# EAGLE design design_block-readable (EAGLE 9.3.0)
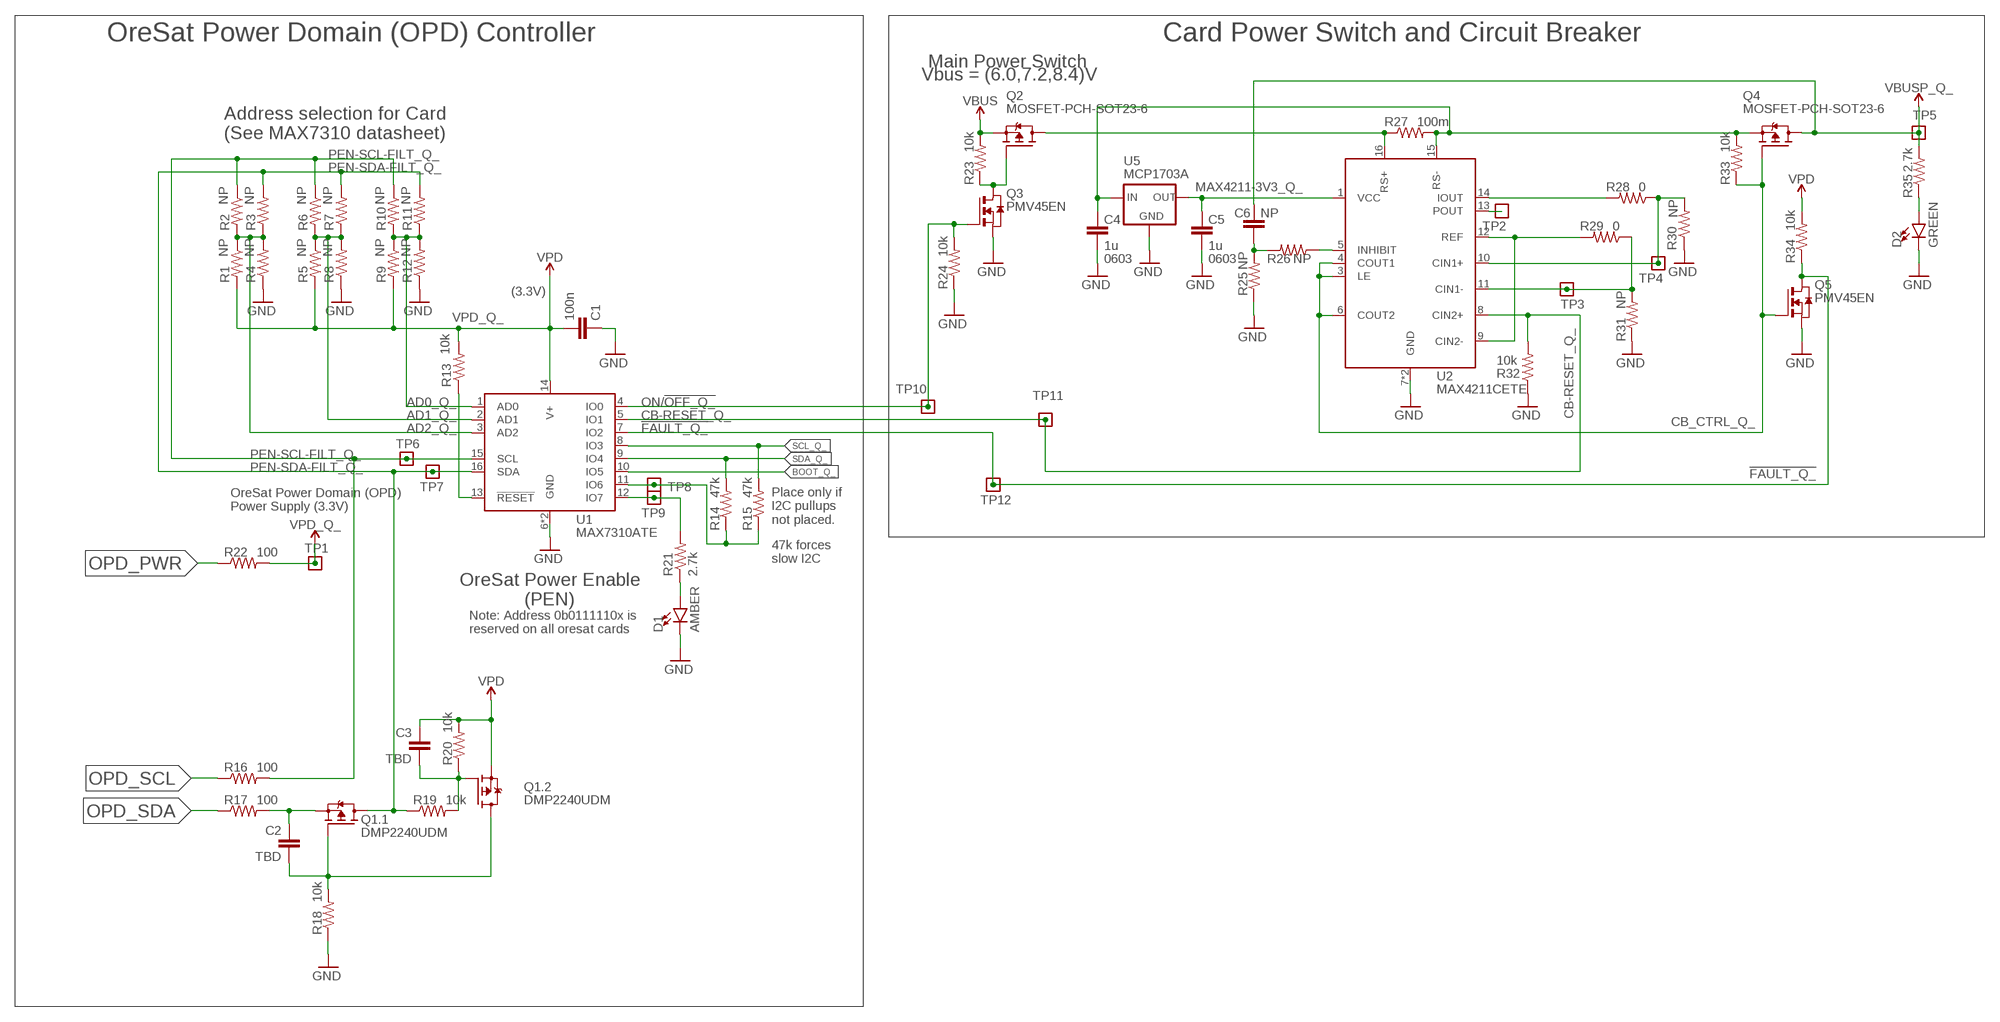
[diagram p0: schematic, sheet 1]

## Parts
C1  100n  C-EU0402-B-NOSILK  [.0402-B-NOSILK]
C2  TBD  C-EU0402-B-NOSILK  [.0402-B-NOSILK]
C3  TBD  C-EU0402-B-NOSILK  [.0402-B-NOSILK]
C4  1u  C-EU0603-B-NOSILK  [.0603-B-NOSILK]
C5  1u  C-EU0603-B-NOSILK  [.0603-B-NOSILK]
C6  NP  C-EU0402-B-NOSILK  [.0402-B-NOSILK]
D1  AMBER  LED-GREEN0603  [LED-0603]
D2  GREEN  LED-GREEN0603  [LED-0603]
Q1  DMP2240UDM  MOSFET-PCH-SOT23-6  [SOT23-6]
Q2  MOSFET-PCH-SOT23-6  [SOT23-6]
Q3  PMV45EN  [SOT23]
Q4  MOSFET-PCH-SOT23-6  [SOT23-6]
Q5  PMV45EN  [SOT23]
R1  NP  R-US_0402-B-NOSILK  [.0402-B-NOSILK]
R2  NP  R-US_0402-B-NOSILK  [.0402-B-NOSILK]
R3  NP  R-US_0402-B-NOSILK  [.0402-B-NOSILK]
R4  NP  R-US_0402-B-NOSILK  [.0402-B-NOSILK]
R5  NP  R-US_0402-B-NOSILK  [.0402-B-NOSILK]
R6  NP  R-US_0402-B-NOSILK  [.0402-B-NOSILK]
R7  NP  R-US_0402-B-NOSILK  [.0402-B-NOSILK]
R8  NP  R-US_0402-B-NOSILK  [.0402-B-NOSILK]
R9  NP  R-US_0402-B-NOSILK  [.0402-B-NOSILK]
R10  NP  R-US_0402-B-NOSILK  [.0402-B-NOSILK]
R11  NP  R-US_0402-B-NOSILK  [.0402-B-NOSILK]
R12  NP  R-US_0402-B-NOSILK  [.0402-B-NOSILK]
R13  10k  R-US_0402-B-NOSILK  [.0402-B-NOSILK]
R14  47k  R-US_0402-B-NOSILK  [.0402-B-NOSILK]
R15  47k  R-US_0402-B-NOSILK  [.0402-B-NOSILK]
R16  100  R-US_0402-B-NOSILK  [.0402-B-NOSILK]
R17  100  R-US_0402-B-NOSILK  [.0402-B-NOSILK]
R18  10k  R-US_0402-B-NOSILK  [.0402-B-NOSILK]
R19  10k  R-US_0402-B-NOSILK  [.0402-B-NOSILK]
R20  10k  R-US_0402-B-NOSILK  [.0402-B-NOSILK]
R21  2.7k  R-US_0402-B-NOSILK  [.0402-B-NOSILK]
R22  100  R-US_0402-B-NOSILK  [.0402-B-NOSILK]
R23  10k  R-US_0402-B-NOSILK  [.0402-B-NOSILK]
R24  10k  R-US_0402-B-NOSILK  [.0402-B-NOSILK]
R25  NP  R-US_0402-B-NOSILK  [.0402-B-NOSILK]
R26  NP  R-US_0402-B-NOSILK  [.0402-B-NOSILK]
R27  100m  R-US_R1206  [R1206]
R28  0  R-US_0402-B-NOSILK  [.0402-B-NOSILK]
R29  0  R-US_0402-B-NOSILK  [.0402-B-NOSILK]
R30  NP  R-US_0402-B-NOSILK  [.0402-B-NOSILK]
R31  NP  R-US_0402-B-NOSILK  [.0402-B-NOSILK]
R32  10k  R-US_0402-B-NOSILK  [.0402-B-NOSILK]
R33  10k  R-US_0402-B-NOSILK  [.0402-B-NOSILK]
R34  10k  R-US_0402-B-NOSILK  [.0402-B-NOSILK]
R35  2.7k  R-US_0402-B-NOSILK  [.0402-B-NOSILK]
TP1  TEST-POINT  [2MM-TEST-POINT]
TP2  TEST-POINT  [2MM-TEST-POINT]
TP3  TEST-POINT  [2MM-TEST-POINT]
TP4  TEST-POINT  [2MM-TEST-POINT]
TP5  TEST-POINT  [2MM-TEST-POINT]
TP6  TEST-POINT  [2MM-TEST-POINT]
TP7  TEST-POINT  [2MM-TEST-POINT]
TP8  TEST-POINT  [2MM-TEST-POINT]
TP9  TEST-POINT  [2MM-TEST-POINT]
TP10  TEST-POINT  [2MM-TEST-POINT]
TP11  TEST-POINT  [2MM-TEST-POINT]
TP12  TEST-POINT  [2MM-TEST-POINT]
U1  MAX7310ATE  MAX7310  [QFN65P400X400X80-17T210]
U2  MAX4211CETE  MAX4211  [QFN65P400X400X80-17T210]
U5  MCP1703A  XC63FPM  [SOT23]

## Nets
!FAULT_Q_: Q5.3(D) R34.1 TP12.1 U1.7(IO2)
AD0_Q_: R9.1 R10.2 R11.1 R12.2 U1.1(AD0)
AD1_Q_: R5.1 R6.2 R7.1 R8.2 U1.2(AD1)
AD2_Q_: R1.1 R2.2 R3.1 R4.2 U1.3(AD2)
BOOT_Q_: U1.10(IO5)
CB-RESET_Q_: R32.2 TP11.1 U1.5(IO1) U2.8(CIN2+)
CB_CTRL_Q_: Q4.3(G) Q5.1(G) R33.1 U2.3(LE) U2.4(COUT1) U2.6(COUT2)
GND: C1.1 C4.2 C5.2 D1.C D2.C Q3.2(S) Q5.2(S) R4.1 R8.1 R12.1 R18.1 R24.1 R25.1 R30.1 R31.1 R32.1 U1.6(GND) U1.EPAD(GND) U2.7(GND) U2.EPAD(GND) U5.1(GND)
MAX4211-3V3_Q_: C5.1 U2.1(VCC) U5.2(OUT)
N$2: D2.A R35.1
N$3: R13.1 U1.13(!RESET)
N$4: Q2.3(G) Q3.3(D) R23.1
N$5: Q2.1(D) Q2.2(D) Q2.5(D) Q2.6(D) R27.1 U2.16(RS+)
N$6: R28.1 R30.2 TP4.1 U2.10(CIN1+)
N$7: R29.1 R31.2 TP3.1 U2.11(CIN1-)
N$8: R28.2 U2.14(IOUT)
N$9: R29.2 U2.9(CIN2-) U2.12(REF)
N$10: TP2.1 U2.13(POUT)
N$11: R26.1 U2.5(INHIBIT)
N$12: C6.1 R25.2 R26.2
N$13: C4.1 Q4.4(S) R27.2 R33.2 U2.15(RS-) U5.3(IN)
N$14: R21.2 TP9.1 U1.12(IO7)
N$15: D1.A R21.1
N$16: C2.1 Q1.5(.1:S) R17.2
N$17: C2.2 Q1.1(.1:G) Q1.4(.2:D) R18.2
N$18: C3.2 Q1.3(.2:G) R19.2 R20.1
N$19: R14.1 R15.1 TP8.1 U1.11(IO6)
ON/!OFF_Q_: Q3.1(G) R24.2 TP10.1 U1.4(IO0)
OPD_PWR: R22.1
OPD_SCL: R16.1
OPD_SDA: R17.1
PEN-SCL-FILT_Q_: R2.1 R6.1 R10.1 R16.2 TP6.1 U1.15(SCL)
PEN-SDA-FILT_Q_: Q1.6(.1:D) R3.2 R7.2 R11.2 R19.1 TP7.1 U1.16(SDA)
SCL_Q_: R15.2 U1.8(IO3)
SDA_Q_: R14.2 U1.9(IO4)
VBUS: Q2.4(S) R23.2
VBUSP_Q_: C6.2 Q4.1(D) Q4.2(D) Q4.5(D) Q4.6(D) R35.2 TP5.1
VPD_Q_: C1.2 C3.1 Q1.2(.2:S) R1.2 R5.2 R9.2 R13.2 R20.2 R22.2 R34.2 TP1.1 U1.14(V+) ; supply symbol labelled VPD

## Notes on the sheet
- OreSat Power Domain (OPD) Controller | Card Power Switch and Circuit Breaker
- Main Power Switch
- Vbus = (6.0,7.2,8.4)V
- Address selection for Card
  (See MAX7310 datasheet)
- 0603 | 0603
- (3.3V)
- OreSat Power Domain (OPD)
  Power Supply (3.3V)
- Place only if
  I2C pullups
  not placed.
- 47k forces
  slow I2C
- OreSat Power Enable
  (PEN)
- Note: Address 0b0111110x is 
  reserved on all oresat cards

## Library data of the parts
C1-C3 C6 = rcl_custom:C-EU: CAPACITOR, European symbol; DIS: Digi-Key; DPN: 1276-1001-1-ND; MFR: Samsung; MPN: CL05B104KO5NNNC
C4 C5 = oresat-rcl:C-EU: CAPACITOR, European symbol; DIS: Digi-Key; DPN: 1276-1001-1-ND; MFR: Samsung; MPN: CL05B104KO5NNNC
D1 = SparkFun-LED:LED-GREEN: Green SMD LED Used in manufacturing of various products at SparkFun Packages: 0603 - SMD 0603 package [Product Link] <http://www.futureelectronics.com/en/technologies/semiconductors/optoelectronics/leds/Pages/9894312-LTST-C190GKT.aspx?CrossPart=HSMG-C190&IM=0> LilyPad 1206 - SMD1206 LilyPad package [Product Link] <http://www.futureelectronics.com/en/Technologies/Product.aspx?ProductID=IN150NGHARVATEKCORPORATION2049943&IM=0> 1206 - SMD1206 package [Product Link] <http://www.futureelectronics.com/en/technologies/semiconductors/optoelectronics/leds/Pages/8315665-LTST-C150KGKT.aspx?IM=0> 1206 Bottom Mount -SMD 1206 Bottom Mount [Product Link] <http://www.digikey.com/product-detail/en/lite-on-inc/LTST-C230KGKT/160-1456-1-ND/386854> SparkFun Products: Pro Mini 328 -5V <https://www.sparkfun.com/products/821> RedBoard <https://www.sparkfun.com/products/12757> MP3 Trigger <https://www.sparkfun.com/products/13720> Makey Makey <https://www.sparkfun.com/products/11076>; VALUE: GREEN
D2 = SparkFun-LED:LED-GREEN: Green SMD LED Used in manufacturing of various products at SparkFun Packages: 0603 - SMD 0603 package [Product Link] <http://www.futureelectronics.com/en/technologies/semiconductors/optoelectronics/leds/Pages/9894312-LTST-C190GKT.aspx?CrossPart=HSMG-C190&IM=0> LilyPad 1206 - SMD1206 LilyPad package [Product Link] <http://www.futureelectronics.com/en/Technologies/Product.aspx?ProductID=IN150NGHARVATEKCORPORATION2049943&IM=0> 1206 - SMD1206 package [Product Link] <http://www.futureelectronics.com/en/technologies/semiconductors/optoelectronics/leds/Pages/8315665-LTST-C150KGKT.aspx?IM=0> 1206 Bottom Mount -SMD 1206 Bottom Mount [Product Link] <http://www.digikey.com/product-detail/en/lite-on-inc/LTST-C230KGKT/160-1456-1-ND/386854> SparkFun Products: Pro Mini 328 -5V <https://www.sparkfun.com/products/821> RedBoard <https://www.sparkfun.com/products/12757> MP3 Trigger <https://www.sparkfun.com/products/13720> Makey Makey <https://www.sparkfun.com/products/11076>
Q1 = Q-MOSFET-PCH-dual-SOT23-6:MOSFET-PCH-SOT23-6: Dual P channel MOSFETs in an SOT23-6; MFR: Diodes Inc; MPN: DMP2240UDM
Q2 Q4 = Q-MOSFET-PCH-SOT23-6:MOSFET-PCH-SOT23-6: P channel MOSFET in an SOT23-6; MFR: Diodes Inc; MPN: DMP3050LVT-7
Q3 Q5 = Tova:PMV45EN
R1-R26 R28-R35 = rcl_custom:R-US_: RESISTOR, American symbol; DIS: Digi-Key; DPN: 1276-4275-1-ND; MFR: Samsung; MPN: RC1005F6653CS
R27 = rcl:R-US_: RESISTOR, American symbol; SPICEPREFIX: R
TP1-TP12 = Tova:TEST-POINT
U1 = U-Maxim-MAX7310-I2C-GPIO-expander:MAX7310; MFR: Maxim; MPN: MAX7310ATE
U2 = U-Maxim-MAX4211-power-monitor:MAX4211; MFR: Maxim; MPN: MAX4211CETE
U5 = v-reg:XC63FP: Positiv Voltage Regulators www.torex.co.jp/english/product/pro02/pdf/0201_xc62fp.pdf; MFR: Microchip; MPN: MCP1703AT-3302E/CB

## Board
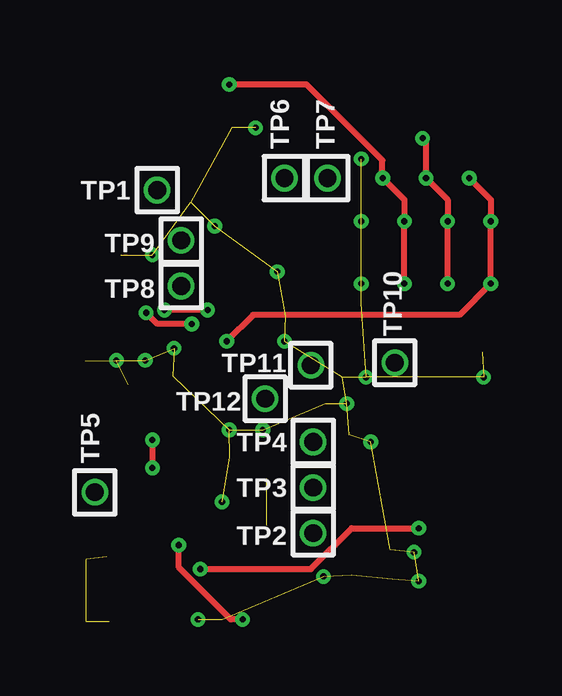
[diagram p1: board, top side]
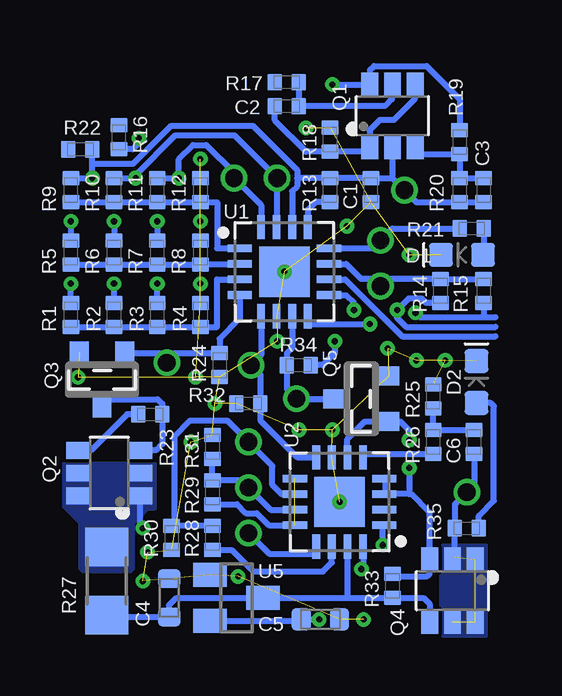
[diagram p2: board, bottom side, seen from below]

No outline drawn. Coordinates in mm, seen from the top.
Copper layers (1*16): Top 0.0356mm / dielectric 1.5011mm / Bottom 0.0356mm
Design rules "OSH-Park-2-layer *": minimum track width 6mil, minimum drill 10mil, track to track 6mil, track to pad 6mil, pad to pad 6mil, via to via 6mil, smd to smd 6mil, copper to edge 15mil, drill to drill 6mil, minimum pad ring 7mil, minimum via ring 7mil, stop-mask expansion 3mil, vias tented up to drill 13mil, thermal gap 10mil

### Footprints (pad centres in the part's own frame; a part is rotated, then mirrored left to right if it is on the bottom)
.0402-B-NOSILK = smd 0.6 x 0.7: 1 -0.5,0; 2 0.5,0
.0603-B-NOSILK = smd 0.8 x 0.95: 1 -0.8,0; 2 0.8,0
LED-0603 = smd 1 x 1: A -0.877,0; C 0.877,0
SOT23-6 = smd 0.7 x 1: 1 -0.95,-1.3; 2 0,-1.3; 3 0.95,-1.3; 4 0.95,1.3; 5 0,1.3; 6 -0.95,1.3
SOT23 = smd 0.787 x 0.889: 1 -0.953,-1.143; 2 0.953,-1.143; 3 0,1.143
R1206 = smd 1.6 x 1.803: 1 -1.422,0; 2 1.422,0
2MM-TEST-POINT = drill 0.737: 1 0,0
QFN65P400X400X80-17T210 = smd 1.01 x 0.32: 1 -1.86,0.975; 2 -1.86,0.325; 3 -1.86,-0.325; 4 -1.86,-0.975; 9 1.86,-0.975; 10 1.86,-0.325; 11 1.86,0.325; 12 1.86,0.975 | smd 0.32 x 1.01: 5 -0.975,-1.86; 6 -0.325,-1.86; 7 0.325,-1.86; 8 0.975,-1.86; 13 0.975,1.86; 14 0.325,1.86; 15 -0.325,1.86; 16 -0.975,1.86 | smd 2.1 x 2.1: EPAD 0,0
SOT23' = smd 1 x 1.4: 1 -0.95,-1.1; 2 0.95,-1.1; 3 0,1.1

### Placement (x,y rotation side)
C1  5.5,18.9 90 bottom
C2  9,22.4 180 bottom
C3  0.8,18.9 90 bottom
C4  13.9,1.9 90 bottom
C5  7.6,1 0 bottom
C6  1.2,8.4 270 bottom
D1  1.7,16.2 180 bottom
D2  1.1,10.9 90 bottom
Q1  4.6,22 0 bottom
Q2  16.4,7.1 90 bottom
Q3  16.7,11 180 bottom
Q4  2.1,2.2 180 bottom
Q5  5.9,10.2 90 bottom
R1  18,13.7 90 bottom
R2  16.2,13.7 270 bottom
R3  14.4,13.7 90 bottom
R4  12.6,13.7 270 bottom
R5  18,16.3 90 bottom
R6  16.2,16.3 270 bottom
R7  14.4,16.3 90 bottom
R8  12.6,16.3 270 bottom
R9  18,18.9 90 bottom
R10  16.2,18.9 270 bottom
R11  14.4,18.9 90 bottom
R12  12.6,18.9 270 bottom
R13  7.2,18.9 90 bottom
R14  2.6,14.7 270 bottom
R15  0.8,14.7 270 bottom
R16  16,21.1 270 bottom
R17  9,23.4 0 bottom
R18  7.2,21 270 bottom
R19  1.8,20.9 270 bottom
R20  1.8,18.9 270 bottom
R21  1.3,17.3 180 bottom
R22  17.6,20.6 0 bottom
R23  14.69,9.55 180 bottom
R24  11.8,11.6 90 bottom
R25  2.9,10.3 270 bottom
R26  2.9,8.4 90 bottom
R27  16.5,2.6 270 bottom
R28  12.1,4.4 270 bottom
R29  12.1,6.3 270 bottom
R30  13.8,4.4 90 bottom
R31  12.1,8.2 270 bottom
R32  10.6,10 0 bottom
R33  4.6,2.4 270 bottom
R34  8.5,11.6 0 bottom
R35  1.5,4.8 180 bottom
TP1  4.1,18.9 180 top
TP2  10.6,4.6 180 top
TP3  10.6,6.5 180 top
TP4  10.6,8.4 0 top
TP5  1.5,6.3 180 top
TP6  9.4,19.4 180 top
TP7  11.2,19.4 180 top
TP8  5.1,14.9 180 top
TP9  5.1,16.8 180 top
TP10  14,11.7 180 top
TP11  10.5,11.6 180 top
TP12  8.6,10.2 180 top
U1  9.1,15.5 0 bottom
U2  6.8,5.9 180 bottom
U5  MCP1703A  [SOT23']  11.1,1.9 270 bottom

### Tracks (layer width: path | path; a pad name or v marks a point on that pad's centre or on a via)
!FAULT_Q_
  Bottom 0.25: Q5.3 TP12.1 9,10.6 R34.1 9,12.1 8.78,12.32 U1.7
AD0_Q_
  Bottom 0.25: R9.1 R10.2 R11.1 R12.2 11.9,18.4 11.9,16.48 U1.1
AD1_Q_
  Bottom 0.25: R5.1 R6.2 R7.1 R8.2 12.57,15.82 U1.2
AD2_Q_
  Bottom 0.25: R1.1 R2.2 R3.1 R4.2 11.9,13.2 11.9,15.18 U1.3
BOOT_Q_
  Bottom 0.25: U1.10 6.58,15.18 4.2,12.8 0.3,12.8
CB-RESET_Q_
  Bottom 0.25: U1.5 10.07,12.03 TP11.1 10.1,11.2 R32.2 10.1,9.3 8.56,7.76 U2.8
CB_CTRL_Q_  (via drill 0.25)
  Top 0.25: v3.9,8.48 v3.9,7.32
  Bottom 0.25: U2.6 6.47,8.53 5.75,9.25 Q5.1 4.26,9.25 3.9,8.88 v3.9,8.48 | R33.1 4.5,2.8 3.15,2.8 3.05,2.9 Q4.3 3.05,5.45 3.83,6.22 3.9,6.22 | 3.9,6.22 4.9,6.22 | 4.9,6.22 U2.3 | U2.4 4.9,6.83 4.9,6.22 | v3.9,7.32 3.9,6.22
GND  (via drill 0.25)  (40 unrouted)
  other vias: 12.6,20.2 12.6,17.6 12.6,15 12.8,11.1 13,8.4 12,10 9.4,12.6 6.5,17.4 8.2,21.5 3.9,16.2 2.4,11.8 3.6,11.8 4.8,12.3 7.1,8.9 8.5,8.9 14.8,3.8 15,2.6 11.03,2.79 5.8,1 17.7,11.1 9.1,15.5 6.8,5.9
MAX4211-3V3_Q_  (via drill 0.25)
  Top 0.25: v7.66,1 7.17,1 5,3.17 v5,4.1
  Bottom 0.25: U5.2 8.45,0.95 C5.1 v7.66,1 | v5,4.1 5,4.87 U2.1
N$2
  Bottom 0.25: R35.1 1,5.33 0.37,5.95 0.37,9.9 0.5,10.02 D2.A
N$3
  Bottom 0.25: R13.1 7.8,18.4 8.12,18.07 U1.13
N$4
  Bottom 0.25: Q3.3 16.7,10.18 14.38,10.18 14.19,9.99 R23.1 14.19,8.31 14.45,8.05 Q2.3
N$5  (via drill 0.25)
  Top 0.25: v5.89,3.1 10.5,3.1 12.2,4.8 v15,4.8
  Bottom 0.25: U2.16 5.83,3.17 v5.89,3.1 | v15,4.8 15.1,4.9 Q2.1
  pour Bottom (no thermals): 14.5,7.5 18.3,7.5 18.3,5.7 17.6,5 17.6,3.1 17.5,3 15.5,3 15.4,3.1 15.4,5 14.8,5.6 14.5,5.6
N$6
  Bottom 0.25: U2.10 9.22,6.22 9.6,6.6 9.6,7.4 TP4.1 10.6,8.41 11.46,9.28 13.04,9.28 13.7,8.61 13.7,5 R30.2 R28.1
N$7
  Bottom 0.25: R31.2 R29.1 10.9,6.8 TP3.1 9.68,5.58 U2.11
N$8
  Bottom 0.25: R28.2 11.3,3.9 10.4,3 7.5,3 7.12,3.38 U2.14
N$9  (1 unrouted)
  Bottom 0.25: R29.2 11.07,5.8 10.7,5.43 10.26,5.43 9.75,4.92 U2.12
N$10
  Bottom 0.25: TP2.1 9.74,3.74 7.78,3.74 U2.13
N$11
  Bottom 0.25: U2.5 5.83,7.9 R26.1
N$12
  Bottom 0.25: R25.2 R26.2 C6.1
N$13
  Bottom 0.25: R27.2 16.42,1.1 C4.1 13.9,1.6 13.6,1.9 U5.3 6.5,1.9 | 6.5,1.9 R33.2 3.3,1.9 3.05,1.65 Q4.4 | U2.15 6.47,1.93 6.5,1.9
N$14
  Bottom 0.25: U1.12 5.42,16.48 TP9.1 4.6,17.3 R21.2
N$15
  Bottom 0.25: R21.1 0.78,17.28 D1.A
N$16
  Bottom 0.25: Q1.5 4.62,23.28 4.62,22.68 4.88,22.42 8.48,22.42 C2.1 R17.2
N$17
  Bottom 0.25: Q1.4 3.67,23.28 3.67,22.68 4.54,21.82 5.13,21.82 5.55,21.4 Q1.1 5.75,20.5 R18.2 8.2,20.5 9.5,21.8 C2.2
N$18
  Bottom 0.25: Q1.3 3.35,20.4 R19.2 R20.1 C3.2
N$19
  Bottom 0.25: U1.11 6.53,15.82 5.9,15.2 5.1,15.2 | 5.1,15.2 R14.1 R15.1 | TP8.1 5.1,15.2
ON/!OFF_Q_
  Bottom 0.25: U1.4 10.96,13.54 11.8,12.7 R24.2 14,12.1 | Q3.1 15.7,12.1 14,12.1 | TP10.1 14,12.1
PEN-SCL-FILT_Q_  (via drill 0.25)
  Top 0.25: v16.2,15 v16.2,17.6 16.2,18.5 v15.3,19.4 15.3,20.92 v15.16,21.06
  Bottom 0.25: R2.1 v16.2,15 | v16.2,17.6 R6.1 | R10.1 v15.3,19.4 15.3,19.52 13.64,21.18 11.19,21.18 TP6.1 9.43,19.38 U1.15 | v15.16,21.06 15.16,20.86 15.42,20.6 R16.2
PEN-SDA-FILT_Q_  (via drill 0.25)
  Top 0.25: v14.4,15 v14.4,17.6 14.4,18.5 v13.5,19.4 13.48,19.42 13.48,20.14 10.32,23.3 v7.1,23.3
  Bottom 0.25: R3.2 v14.4,15 | v14.4,17.6 R7.2 | R11.2 v13.5,19.4 13.5,20.18 12.9,20.78 12.36,20.78 11.2,19.62 TP7.1 10.07,18.27 U1.16 | v7.1,23.3 Q1.6 5.53,23.32 5.53,23.91 5.37,24.08 3.18,24.08 1.8,22.7 R19.1
SCL_Q_  (via drill 0.25)
  Top 0.25: v5.54,13.32 4.11,13.32 v3.64,13.79
  Bottom 0.25: U1.8 8.12,13.34 8.1,13.32 v5.54,13.32 | v3.64,13.79 3.46,13.61 0.8,13.61 | 0.8,13.61 0.3,13.61 | R15.2 0.8,13.61
SDA_Q_  (via drill 0.25)
  Top 0.25: v6.2,13.9 v4.4,13.9
  Bottom 0.25: U1.9 6.54,14.53 6.2,14.19 v6.2,13.9 | R14.2 3.2,14.2 3.4,14.4 3.9,14.4 v4.4,13.9 4.4,13.57 4.03,13.2 0.3,13.2
VBUS
  Bottom 0.25: R23.2 15.65,9.55 17.15,8.05 Q2.4
VBUSP_Q_  (3 unrouted)
  Bottom 0.25: C6.2 1.2,6.6 TP5.1 2,5.8 R35.2 2,3.6 Q4.2
  pour Bottom (no thermals): 0.7,4.1 2.5,4.1 2.6,4 2.6,0.4 2.5,0.3 0.7,0.3
VPD_Q_  (via drill 0.25)
  Top 0.25: v17.1,19.4 18,18.5 v18,17.6 v18,15 16.7,13.7 8.1,13.7 v7,12.6
  Bottom 0.25: R1.2 v18,15 | v18,17.6 R5.2 | R9.2 v17.1,19.4 | 8.57,19.4 8.57,19.74 10.41,21.59 13.81,21.59 15.4,20 17.1,20 v17.1,19.4 | 8.57,19.4 8.57,19.06 8.78,18.85 U1.14 | v17.1,19.4 R22.2 | 8.57,19.4 R13.2 C1.2 4.6,19.4 | 4.6,19.4 TP1.1 3.6,18.4 R20.2 C3.1 | Q1.2 4.6,19.4 | v7,12.6 7,12.1 7.5,11.6 R34.2